# EAGLE design imu_69-v2 (EAGLE 9.6.2)
COMPANY: ADAFRUIT INDUSTRIES; DRAWN: KTOWN; REV: A
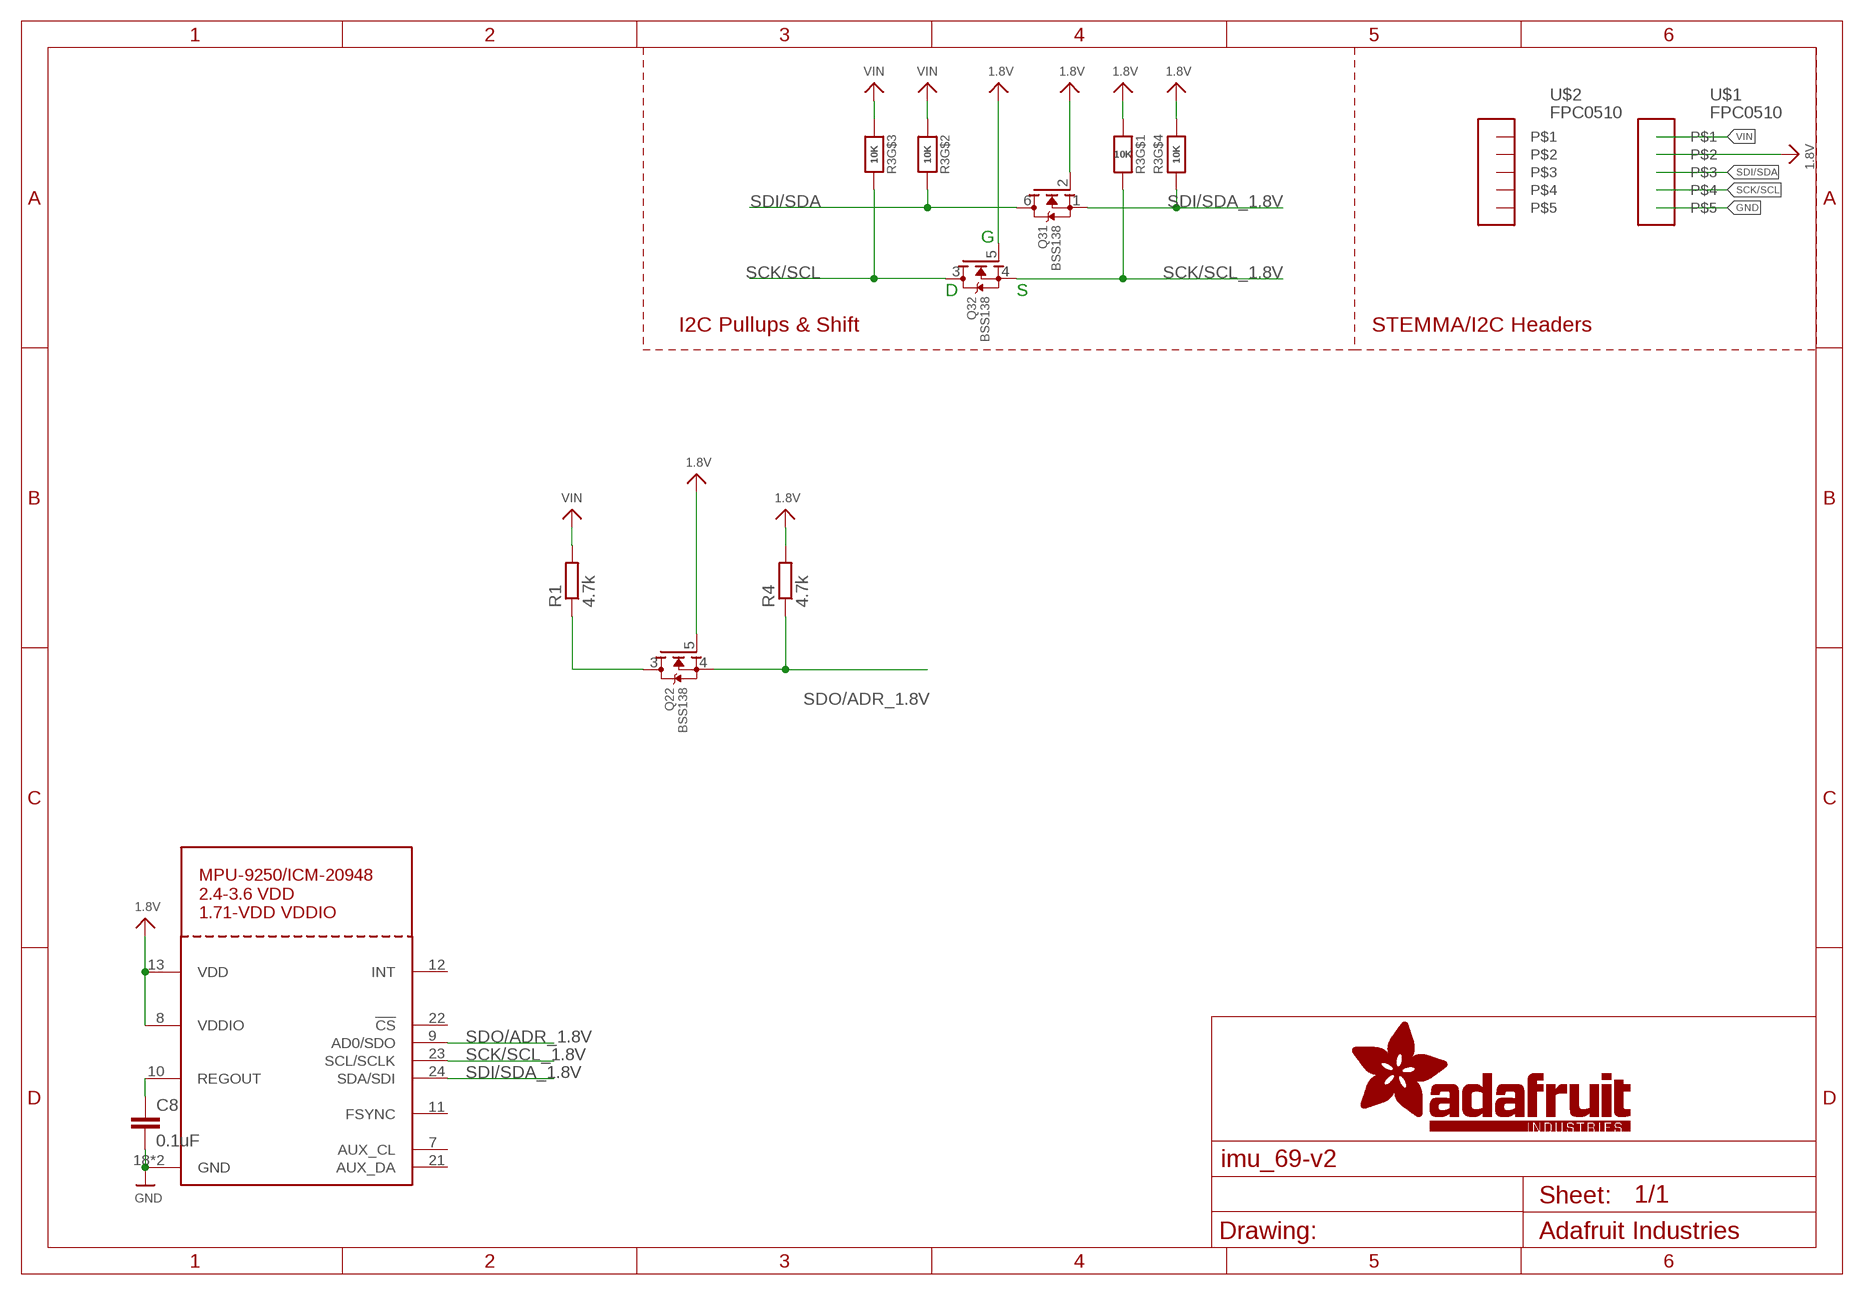
[diagram p0: schematic, sheet 1]

## Parts
C8  0.1uF  C-EUC0201  [C0201]
Q2  BSS138  MOSFET-N_DUAL  [SOT363]
Q3  BSS138  MOSFET-N_DUAL  [SOT363]
R1  4.7k  R-EU_R0402  [R0402]
R3  10K  RESISTOR_4PACK  [RESPACK_4X0603]
R4  4.7k  R-EU_R0402  [R0402]
U$1  FPC0510  [FPC0510]
U$2  FPC0510  [FPC0510]
U$21  MPU-9250_ICM20948  [QFN24_3MM_NOEP]

## Nets
1.8V: Q2.5(2:G) Q3.2(1:G) Q3.5(2:G) R3.4 R3.8 R4.2 U$1.P$2 U$21.8(VDDIO) U$21.13(VDD)
GND: C8.2 U$1.P$5 U$21.18(GND) U$21.20(GND)
REGOUT: C8.1 U$21.10(REGOUT)
SCK/SCL: Q3.3(2:D) R3.6 U$1.P$4
SCK/SCL_1.8V: Q3.4(2:S) R3.1 U$21.23(SCL/SCLK)
SDI/SDA: Q3.6(1:D) R3.7 U$1.P$3
SDI/SDA_1.8V: Q3.1(1:S) R3.5 U$21.24(SDA/SDI)
SDO/ADR: Q2.3(2:D) R1.1
SDO/ADR_1.8V: Q2.4(2:S) R4.1 U$21.9(AD0/SDO)
VIN: R1.2 R3.2 R3.3 U$1.P$1
Unconnected: Q2.1(1:S) Q2.2(1:G) Q2.6(1:D) U$2.P$1 U$2.P$2 U$2.P$3 U$2.P$4 U$2.P$5 U$21.7(AUX_CL) U$21.11(FSYNC) U$21.12(INT) U$21.21(AUX_DA) U$21.22(!CS)

## Notes on the sheet
- G
- D | S
- I2C Pullups & Shift | STEMMA/I2C Headers

## Library data of the parts
C8 = rcl:C-EU: CAPACITOR, European symbol; SPICEPREFIX: C
Q2 Q3 = microbuilder:MOSFET-N_DUAL: Dual N-Channel MOSFET SOT363 (2.0x1.25mm) 2N7002PS - 60V, 320mA [Digikey: 568-5984-1-ND]
R1 R4 = rcl:R-EU_: RESISTOR, European symbol; SPICEPREFIX: R
R3 = microbuilder:RESISTOR_4PACK: Resistor Packs (4 resistors) 4 x 0603 10K 1/16W - Digikey: YC164J-10KCT-ND
U$1 U$2 = my_library:FPC0510
U$21 = adafruit_sensor:MPU-9250: MPU-9250 3-Axis gyroscope and 3-Axis accelerometer

## Net classes
1 highpower: width 0.406 mm, drill 0.483 mm
2 lowpower: width 0.305 mm, drill 0.483 mm

## Board
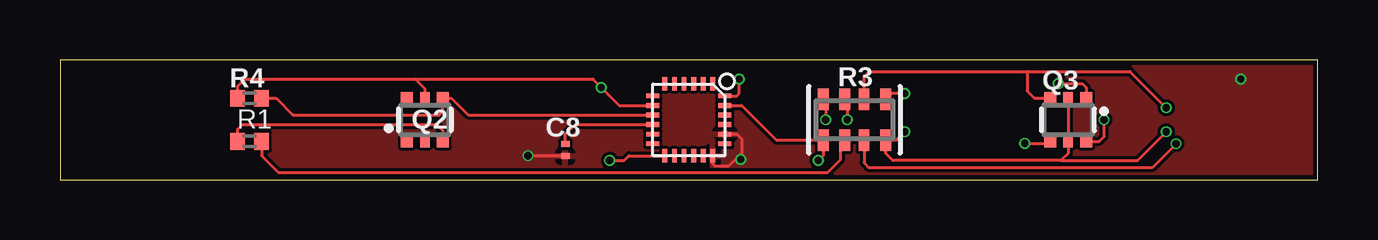
[diagram p1: board, top side]
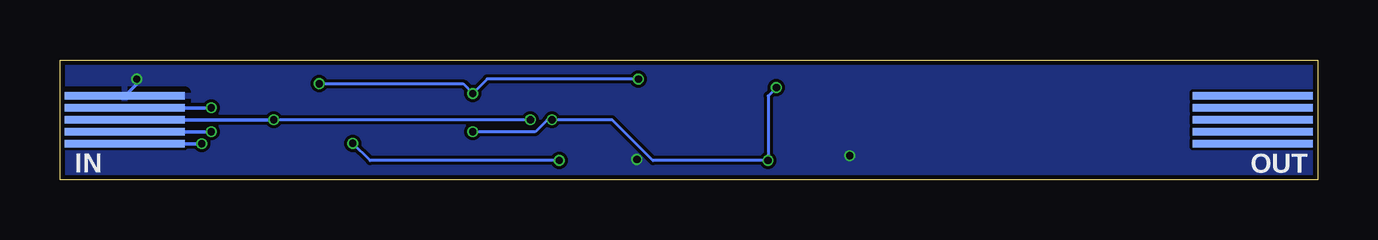
[diagram p2: board, bottom side, seen from below]

Size 52.4 x 5 mm. Coordinates in mm from the lower left corner, seen from the top.
Outline: 0,0 52.4,0 52.4,5 0,5 0,0
Copper layers (1*16): Top 0.035mm / dielectric 1.6mm / Bottom 0.035mm
Design rules "jlcpcb-2layers *": minimum track width 5mil, minimum drill 0.3mm, track to track 5mil, track to pad 5mil, pad to pad 5mil, via to via 5mil, smd to smd 5mil, copper to edge 0.2mm, drill to drill 6mil, minimum pad ring 10mil, minimum via ring 3mil, stop-mask expansion 4mil, vias tented up to drill 12mil, thermal gap 10mil

### Footprints (pad centres in the part's own frame; a part is rotated, then mirrored left to right if it is on the bottom)
C0201 = smd 0.25 x 0.35: 1 -0.25,0; 2 0.25,0
SOT363 = smd 0.5 x 0.5: 1 -0.75,-0.9; 3 0.75,-0.9; 4 0.75,0.9; 6 -0.75,0.9 | smd 0.4 x 0.5: 2 0,-0.9; 5 0,0.9
R0402 = smd 0.6 x 0.7: 1 -0.5,0; 2 0.5,0
RESPACK_4X0603 = smd 0.45 x 0.9: 1 -1.3,-0.85; 2 -0.4,-0.85; 3 0.4,-0.85; 4 1.3,-0.85; 5 1.3,0.85; 6 0.4,0.85; 7 -0.4,0.85; 8 -1.3,0.85
FPC0510 = smd 0.3 x 5: P$1 -1,0.1; P$2 -0.5,0.1; P$3 0,0.1; P$4 0.5,0.1; P$5 1,0.1
QFN24_3MM_NOEP = smd 0.55 x 0.2: 1 -1.5,1; 2 -1.5,0.6; 3 -1.5,0.2; 4 -1.5,-0.2; 5 -1.5,-0.6; 6 -1.5,-1; 13 1.5,-1; 14 1.5,-0.6; 15 1.5,-0.2; 16 1.5,0.2; 17 1.5,0.6; 18 1.5,1 | smd 0.2 x 0.55: 7 -1,-1.5; 8 -0.6,-1.5; 9 -0.2,-1.5; 10 0.2,-1.5; 11 0.6,-1.5; 12 1,-1.5; 19 1,1.5; 20 0.6,1.5; 21 0.2,1.5; 22 -0.2,1.5; 23 -0.6,1.5; 24 -1,1.5

### Placement (x,y rotation side)
C8  21.06,1.23 270 top
Q2  15.2,2.5 0 top
Q3  42,2.5 180 top
R1  7.9,1.6 0 top
R3  33.1,2.5 0 top
R4  7.9,3.4 180 top
U$1  49.6,2.5 90 bottom
U$2  2.8,2.5 270 bottom
U$21  26.2,2.5 270 top

### Tracks (layer width: path | path; a pad name or v marks a point on that pad's centre or on a via)
1.8V  (via drill 0.3)
  Top 0.127: Q3.2 Q3.5 42,1.1 41.7,0.8 | 41.7,0.8 34.7,0.8 34.4,1.1 R3.4 34.85,1.65 v35.2,2 | 41.7,0.8 44.9,0.8 v46.1,2 | 14.8,4.2 7.7,4.2 7.4,3.9 R4.2 | 14.8,4.2 15.2,3.8 Q2.5 | 14.8,4.2 22.2,4.2 v22.55,3.85 23.3,3.1 U$21.8 | v22.9,0.8 23.5,0.8 23.7,1 U$21.13 | R3.8 31.9,3.25 v31.9,2.5
  Bottom 0.127: v35.2,2 32.6,2 32.1,2.5 v31.9,2.5 29.4,2.5 27.7,0.8 v22.9,0.8 22.9,3.5 v22.55,3.85
  Bottom 0.152: v46.1,2 U$1.P$2
GND  (via drill 0.3)
  Top 0.127: C8.2 19.52,0.98 v19.5,1 | U$21.20 28.2,1.9 28.4,1.7 28.4,1.1 28.25,0.95 | U$21.18 27.2,0.65 27.3,0.55 27.85,0.55 28.25,0.95 | 28.25,0.95 v28.36,0.84
  Bottom 0.152: U$1.P$5 49.2,4 v49.2,4.2
  pour Top: 0.1,5 52.5,5 52.5,0 0.1,0
  pour Bottom: 0.1,5 52.5,5 52.5,0 0.1,0
REGOUT
  Top 0.127: C8.1 21.06,1.9 21.46,2.3 U$21.10
SCK/SCL  (via drill 0.3)
  Top 0.127: 40.3,4.52 33.72,4.52 33.5,4.3 R3.6 | 40.3,4.52 44.58,4.52 v46.1,3 | 40.3,4.52 40.3,3.7 40.6,3.4 Q3.3
  Bottom 0.152: v46.1,3 U$1.P$4
SCK/SCL_1.8V  (via drill 0.3)
  Top 0.127: 31.8,1.3 R3.1 | R3.1 31.8,1 v31.6,0.8 | 27.9,3.1 U$21.23 28.4,3.1 29.85,1.65 R3.1 | v40.2,1.52 41.23,1.52 Q3.4
  Bottom 0.127: v40.2,1.52 39.48,0.8 v31.6,0.8
SDI/SDA  (via drill 0.3)
  Top 0.127: R3.7 32.8,3.45 v32.8,2.5 | v43.5,2.5 43.5,1.8 43.3,1.6 Q3.6
  Bottom 0.127: v32.8,2.5 v43.5,2.5
  Bottom 0.152: v43.5,2.5 U$1.P$3
SDI/SDA_1.8V  (via drill 0.3)
  Top 0.127: v35.2,3.6 34.45,3.6 R3.5 | Q3.1 42.75,3.85 42.6,4 v41.6,4 | U$21.24 28.2,3.5 28.3,3.6 v28.3,4.2
  Bottom 0.127: v41.6,4 35.6,4 v35.2,3.6 34.6,4.2 v28.3,4.2
SDO/ADR
  Top 0.127: Q2.3 15.95,2.05 15.7,2.3 7.6,2.3 7.4,2.1 R1.1
SDO/ADR_1.8V
  Top 0.127: R4.1 9,3.4 9.7,2.7 15.8,2.7 15.95,2.85 Q2.4 16.3,3.4 17,2.7 U$21.9
VIN  (via drill 0.3)
  Top 0.127: R1.2 8.4,1 9.1,0.3 31.99,0.3 32.52,0.83 32.52,1.67 R3.2 R3.3 33.5,0.7 33.7,0.5 45.5,0.5 v46.5,1.5
  Bottom 0.152: v46.5,1.5 U$1.P$1

### Text on the board
bPlace: OUT | IN